# Altium schematic sheet RAA214023GNP#HCA.SchDoc
size A4; SheetNumber: 3; SheetTotal: 4
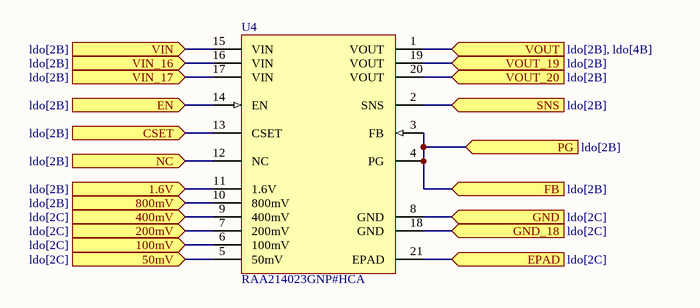
[diagram p0: RAA214023GNP#HCA.SchDoc]

## Parts
U4  RAA214023GNP#HCA  [L20_3_5x3_5_MFG]

## Ports
1.6V (see ldo[2B]), 50mV (see ldo[2C]), 100mV (see ldo[2C]), 200mV (see ldo[2C]), 400mV (see ldo[2C]), 800mV (see ldo[2B]), CSET (see ldo[2B]), EN (in, see ldo[2B]), EPAD (see ldo[2C]), FB (in, see ldo[2B]), GND (see ldo[2C]), GND_18 (see ldo[2C]), NC (see ldo[2B]), PG (see ldo[2B]), SNS (see ldo[2B]), VIN (see ldo[2B]), VIN_16 (see ldo[2B]), VIN_17 (see ldo[2B]), VOUT (see ldo[2B], ldo[4B]), VOUT_19 (see ldo[2B]), VOUT_20 (see ldo[2B])

## Nets
1.6V: U4.11(1.6V) ; port 1.6V
50mV: U4.5(50mV) ; port 50mV
100mV: U4.6(100mV) ; port 100mV
200mV: U4.7(200mV) ; port 200mV
400mV: U4.9(400mV) ; port 400mV
800mV: U4.10(800mV) ; port 800mV
CSET: U4.13(CSET) ; port CSET
EN: U4.14(EN) ; port EN
EPAD: U4.21(EPAD) ; port EPAD
FB: U4.3(FB) U4.4(PG) ; port FB, port PG
GND: U4.8(GND) ; port GND
GND_18: U4.18(GND) ; port GND_18
NC: U4.12(NC) ; port NC
SNS: U4.2(SNS) ; port SNS
VIN: U4.15(VIN) ; port VIN
VIN_16: U4.16(VIN) ; port VIN_16
VIN_17: U4.17(VIN) ; port VIN_17
VOUT: U4.1(VOUT) ; port VOUT
VOUT_19: U4.19(VOUT) ; port VOUT_19
VOUT_20: U4.20(VOUT) ; port VOUT_20

## Library data of the parts
U4 = CMP-00572-126438255-2: LDO Voltage Regulators 2A Low Noise LDO, 20 Lead 3.5x3.5 QFN (NiPdAu-Ag lead finish; Manufacturer Lifecycle Status: ACTIVE; Min Output Voltage: 5V; Max Junction Temperature (Tj): 150°C; Dropout Voltage: 420mV; Max Supply Voltage: 5.5V; Output Voltage: 800mV; Quiescent Current: 195µA; Min Supply Voltage: 2.7V; RAM Size: 1.5kB; Pitch: 500µm; Case/Package: QFN; Width: 3.5mm; ComponentLink3Description: Manufacturer's Package Drawing; ComponentLink1Description: Manufacturer's Website; HelpURL: https://octopart.com/cad-content/api/get-model-datasheet/15189/126438255; ComponentLink3URL: https://www.renesas.com/en/document/psc/l2035x35-20-lead-quad-flat-no-lead-package-qfn; Height: 900µm; Max Operating Temperature: 85°C; Number of Pins: 20; Max Output Current: 2A; Max Input Voltage: 5.5V; Length: 3.5mm; ComponentLink2URL: https://octopart.com/cad-content/api/get-model-datasheet/15189/126438255; ComponentLink2Description: Datasheet URL; Min Input Voltage: 2.7V; Mount: Surface Mount; Max Output Voltage: 800mV; RoHS: Compliant; ComponentLink1URL: http://www.renesas.com; Min Operating Temperature: -40°C; Lifecycle Status: Production